# Altium schematic sheet CPU.SchDoc
size A; PageSetup: Record=PageOptions|CenterHorizontal=True|CenterVertical=True|PrintScale=1.05|XCorrection=1.00|YCorrection=1.00|PrintKind=1|BorderSize=5000000|LeftOffset=0|BottomOffset=0|Orientation=2|PaperLength=1000|PaperWidth=1000|Scale=100|PaperSource=262|PrintQuality=600|MediaType=1|DitherType=10|PaperKind=Letter|PrintScaleMode=1
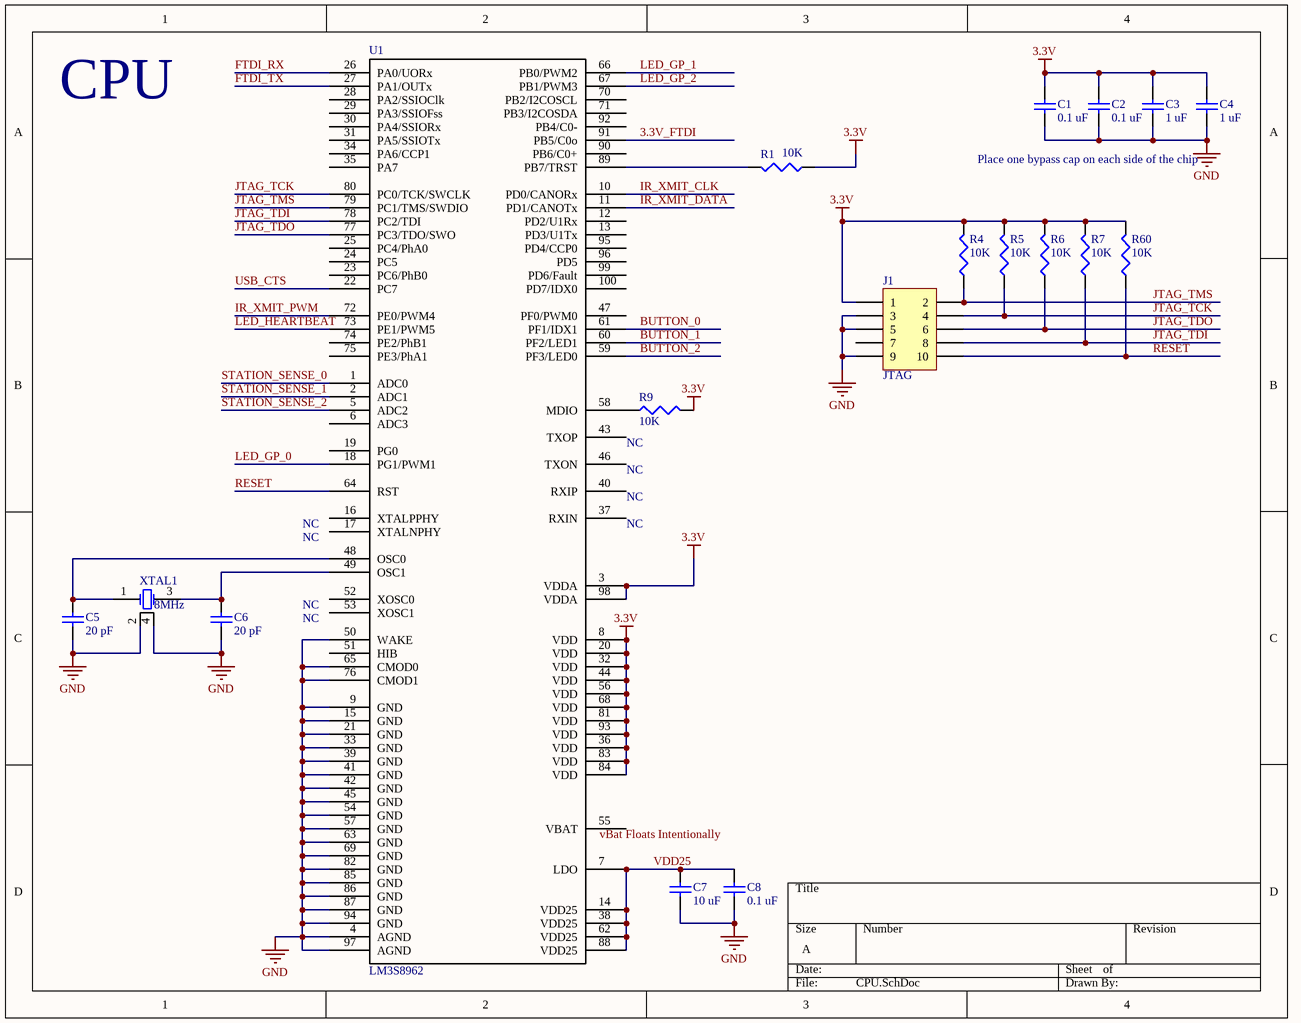
[diagram p0: CPU.SchDoc]

## Parts
C1  value 0.1 uF  [CAPC1005L]
C2  value 0.1 uF  [CAPC1005L]
C3  value 1 uF  [CAPC1608L]
C4  value 1 uF  [CAPC1608L]
C5  value 20 pF  [CAPC1005L]
C6  value 20 pF  [CAPC1005L]
C7  value 10 uF  [CAPC1608L]
C8  value 0.1 uF  [CAPC1005L]
J1  JTAG  [JTAG-10]
R1  value 10K  [RESC1608L]  (hidden comment: Res3)
R4  value 10K  [RESC1608L]  (hidden comment: Res3)
R5  value 10K  [RESC1608L]  (hidden comment: Res3)
R6  value 10K  [RESC1608L]  (hidden comment: Res3)
R7  value 10K  [RESC1608L]  (hidden comment: Res3)
R9  value 10K  [RESC1608L]  (hidden comment: Res3)
R60  value 10K  [RESC1608L]  (hidden comment: Res3)
U1  LM3S8962  [LQFP-100]
XTAL1  8MHz  [CRYSTAL]

## Nets
3.3V: C1.2 C2.2 C3.2 C4.2 J1.1 R1.1 R4.2 R5.2 R6.2 R7.2 R9.2 R60.2 U1.3(VDDA) U1.8(VDD) U1.20(VDD) U1.32(VDD) U1.36(VDD) U1.44(VDD) U1.56(VDD) U1.68(VDD) U1.81(VDD) U1.83(VDD) U1.84(VDD) U1.93(VDD) U1.98(VDDA)
GND: C1.1 C2.1 C3.1 C4.1 C5.1 C6.1 C7.1 C8.1 J1.3 J1.5 J1.9 U1.4(AGND) U1.9(GND) U1.15(GND) U1.21(GND) U1.33(GND) U1.39(GND) U1.41(GND) U1.42(GND) U1.45(GND) U1.50(WAKE) U1.54(GND) U1.57(GND) U1.63(GND) U1.65(CMOD0) U1.69(GND) U1.76(CMOD1) U1.82(GND) U1.85(GND) U1.86(GND) U1.87(GND) U1.94(GND) U1.97(AGND) XTAL1.2(GND) XTAL1.4(GND)
3.3V_FTDI: U1.91(PB5/C0o)
BUTTON_0: U1.61(PF1/IDX1)
BUTTON_1: U1.60(PF2/LED1)
BUTTON_2: U1.59(PF3/LED0)
FTDI_RX: U1.26(PA0/UORx)
FTDI_TX: U1.27(PA1/OUTx)
IR_XMIT_CLK: U1.10(PD0/CANORx)
IR_XMIT_DATA: U1.11(PD1/CANOTx)
IR_XMIT_PWM: U1.72(PE0/PWM4)
JTAG_TCK: J1.4 R5.1 U1.80(PC0/TCK/SWCLK)
JTAG_TDI: J1.8 R7.1 U1.78(PC2/TDI)
JTAG_TDO: J1.6 R6.1 U1.77(PC3/TDO/SWO)
JTAG_TMS: J1.2 R4.1 U1.79(PC1/TMS/SWDIO)
LED_GP_0: U1.18(PG1/PWM1)
LED_GP_1: U1.66(PB0/PWM2)
LED_GP_2: U1.67(PB1/PWM3)
LED_HEARTBEAT: U1.73(PE1/PWM5)
RESET: J1.10 R60.1 U1.64(RST)
STATION_SENSE_0: U1.1(ADC0)
STATION_SENSE_1: U1.2(ADC1)
STATION_SENSE_2: U1.5(ADC2)
USB_CTS: U1.22(PC7)
VDD25: C7.2 C8.2 U1.7(LDO) U1.14(VDD25) U1.38(VDD25) U1.62(VDD25) U1.88(VDD25)
NetC5_2: C5.2 U1.48(OSC0) XTAL1.1(OSC1)
NetC6_2: C6.2 U1.49(OSC1) XTAL1.3(OSC2)
NetR1_2: R1.2 U1.89(PB7/TRST)
NetR9_1: R9.1 U1.58(MDIO)

Not connected (* = marked no-connect by the designer): J1 7; U1 6(ADC3) 12(PD2/U1Rx) 13(PD3/U1Tx) 16(XTALPPHY) 17(XTALNPHY) 19(PG0) 23(PC6/PhB0) 24(PC5) 25(PC4/PhA0) 28(PA2/SSIOClk) 29(PA3/SSIOFss) 30(PA4/SSIORx) 31(PA5/SSIOTx) 34(PA6/CCP1) 35(PA7) 37(RXIN) 40(RXIP) 43(TXOP) 46(TXON) 47(PF0/PWM0) 51(HIB) 52(XOSC0) 53(XOSC1) 55(VBAT) 70(PB2/I2COSCL) 71(PB3/I2COSDA) 74(PE2/PhB1) 75(PE3/PhA1) 90(PB6/C0+) 92(PB4/C0-) 95(PD4/CCP0) 96(PD5) 99(PD6/Fault) 100(PD7/IDX0)

## Notes on the sheet
- CPU
- Place one bypass cap on each side of the chip
- NC
- (near U1) NC
- (near U1) vBat Floats Intentionally

## Library data of the parts
C1-C8 = Cap: Capacitor; Published: 8-Jun-2000; LatestRevisionDate: 17-Jul-2002; LatestRevisionNote: Re-released for DXP Platform.; PackageReference: RAD-0.3; Publisher: Altium Limited
J1 = Header 5X2H: Header, 5-Pin, Dual row, Right Angle; LatestRevisionDate: 17-Jul-2002; LatestRevisionNote: Re-released for DXP Platform.; Publisher: Altium Limited
R1 R4-R7 R9 R60 = Res3: Resistor; Published: 8-Jun-2000; LatestRevisionDate: 29-May-2009; LatestRevisionNote: IPC-7351 Footprint Added.; PackageReference: J1-0603; Publisher: Altium Limited; PackageDescription: Chip Resistor
XTAL1 = Crystal